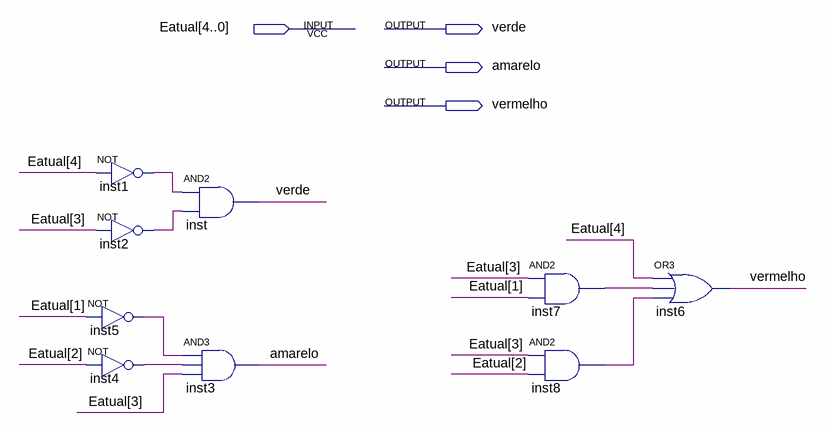
[diagram p0: schematic sheet]
// Quartus schematic LogSaida.bdf as structural Verilog: 9 symbols, 4 pins
module LogSaida (
  input  [4:0] Eatual,
  output verde,
  output amarelo,
  output vermelho
);

  wire inst1_out, inst2_out, inst4_out, inst5_out, inst7_out, inst8_out;

  not inst1 (inst1_out, Eatual[4]);
  not inst2 (inst2_out, Eatual[3]);
  not inst5 (inst5_out, Eatual[1]);
  not inst4 (inst4_out, Eatual[2]);
  and inst (verde, inst1_out, inst2_out);
  and inst3 (amarelo, inst5_out, inst4_out, Eatual[3]);
  and inst7 (inst7_out, Eatual[3], Eatual[1]);
  and inst8 (inst8_out, Eatual[3], Eatual[2]);
  or inst6 (vermelho, Eatual[4], inst7_out, inst8_out);
endmodule
